# EAGLE schematic ReflowWiring (EAGLE 7.6.0)
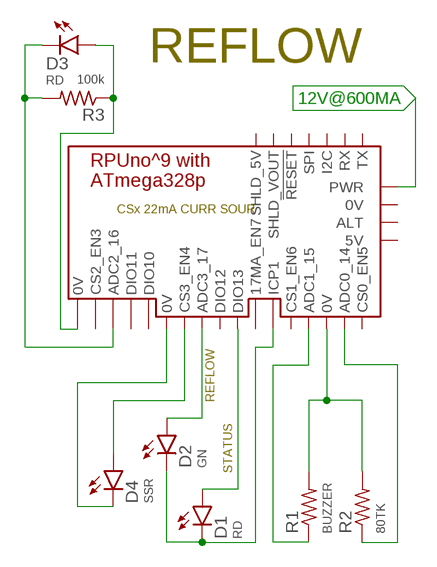
[diagram p0: schematic, sheet 1]

## Parts
BM1  RPUNO  [NA-30]
D1  RD  LED5MM  [LED5MM]
D2  GN  LED5MM  [LED5MM]
D3  RD  LED5MM  [LED5MM]
D4  SSR  LED5MM  [LED5MM]
R1  BUZZER  R0805  [C0805(2012)]
R2  80TK  R0805  [C0805(2012)]
R3  100k  R0805  [C0805(2012)]

## Nets
12V@600MA: BM1.8(PWR)
DIO13: BM1.18(DIO13) D1.A
N$1: BM1.16(ADC3_17) D2.A
N$2: BM1.12(ICP1) D1.K D2.K
N$3: BM1.29(CS3_EN4) D4.A
N$4: BM1.26(0V) R1.2 R2.2
N$5: BM1.28(0V) D4.K
N$6: BM1.10(ADC1_15) R1.1
N$7: BM1.11(ADC0_14) R2.1
N$8: BM1.27(0V) D3.A R3.1
N$9: BM1.13(ADC2_16) D3.K R3.2
Unconnected: BM1.1(TX) BM1.2(RX) BM1.3(I2C) BM1.4(SPI) BM1.5(!RESET) BM1.6(SHLD_5V) BM1.7(SHLD_VOUT) BM1.9(0V) BM1.14(DIO11) BM1.15(DIO10) BM1.17(DIO12) BM1.19(5V) BM1.20(ALT) BM1.21(17MA_EN7) BM1.22(CS1_EN6) BM1.23(CS0_EN5) BM1.24(CS2_EN3)

## Notes on the sheet
- REFLOW
- REFLOW
- STATUS

## Library data of the parts
BM1 = Documentation:RPUNO: BM /w 328p
D1-D4 = D-LED:LED: LED 120120WH [CREE,XHGAWT-00-0000-00000HXE1] LED WHITE 6500K 150LUM-W120120
R1-R3 = R-C:R: Resiistor American-style symbol